# EAGLE design EMG (EAGLE 9.6.2)
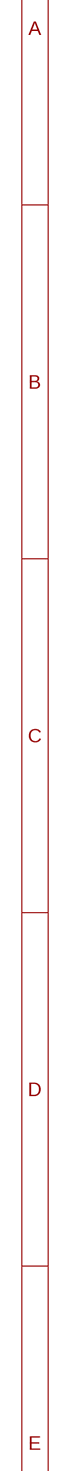
[diagram p0: schematic, sheet 1, part 1 of 2]
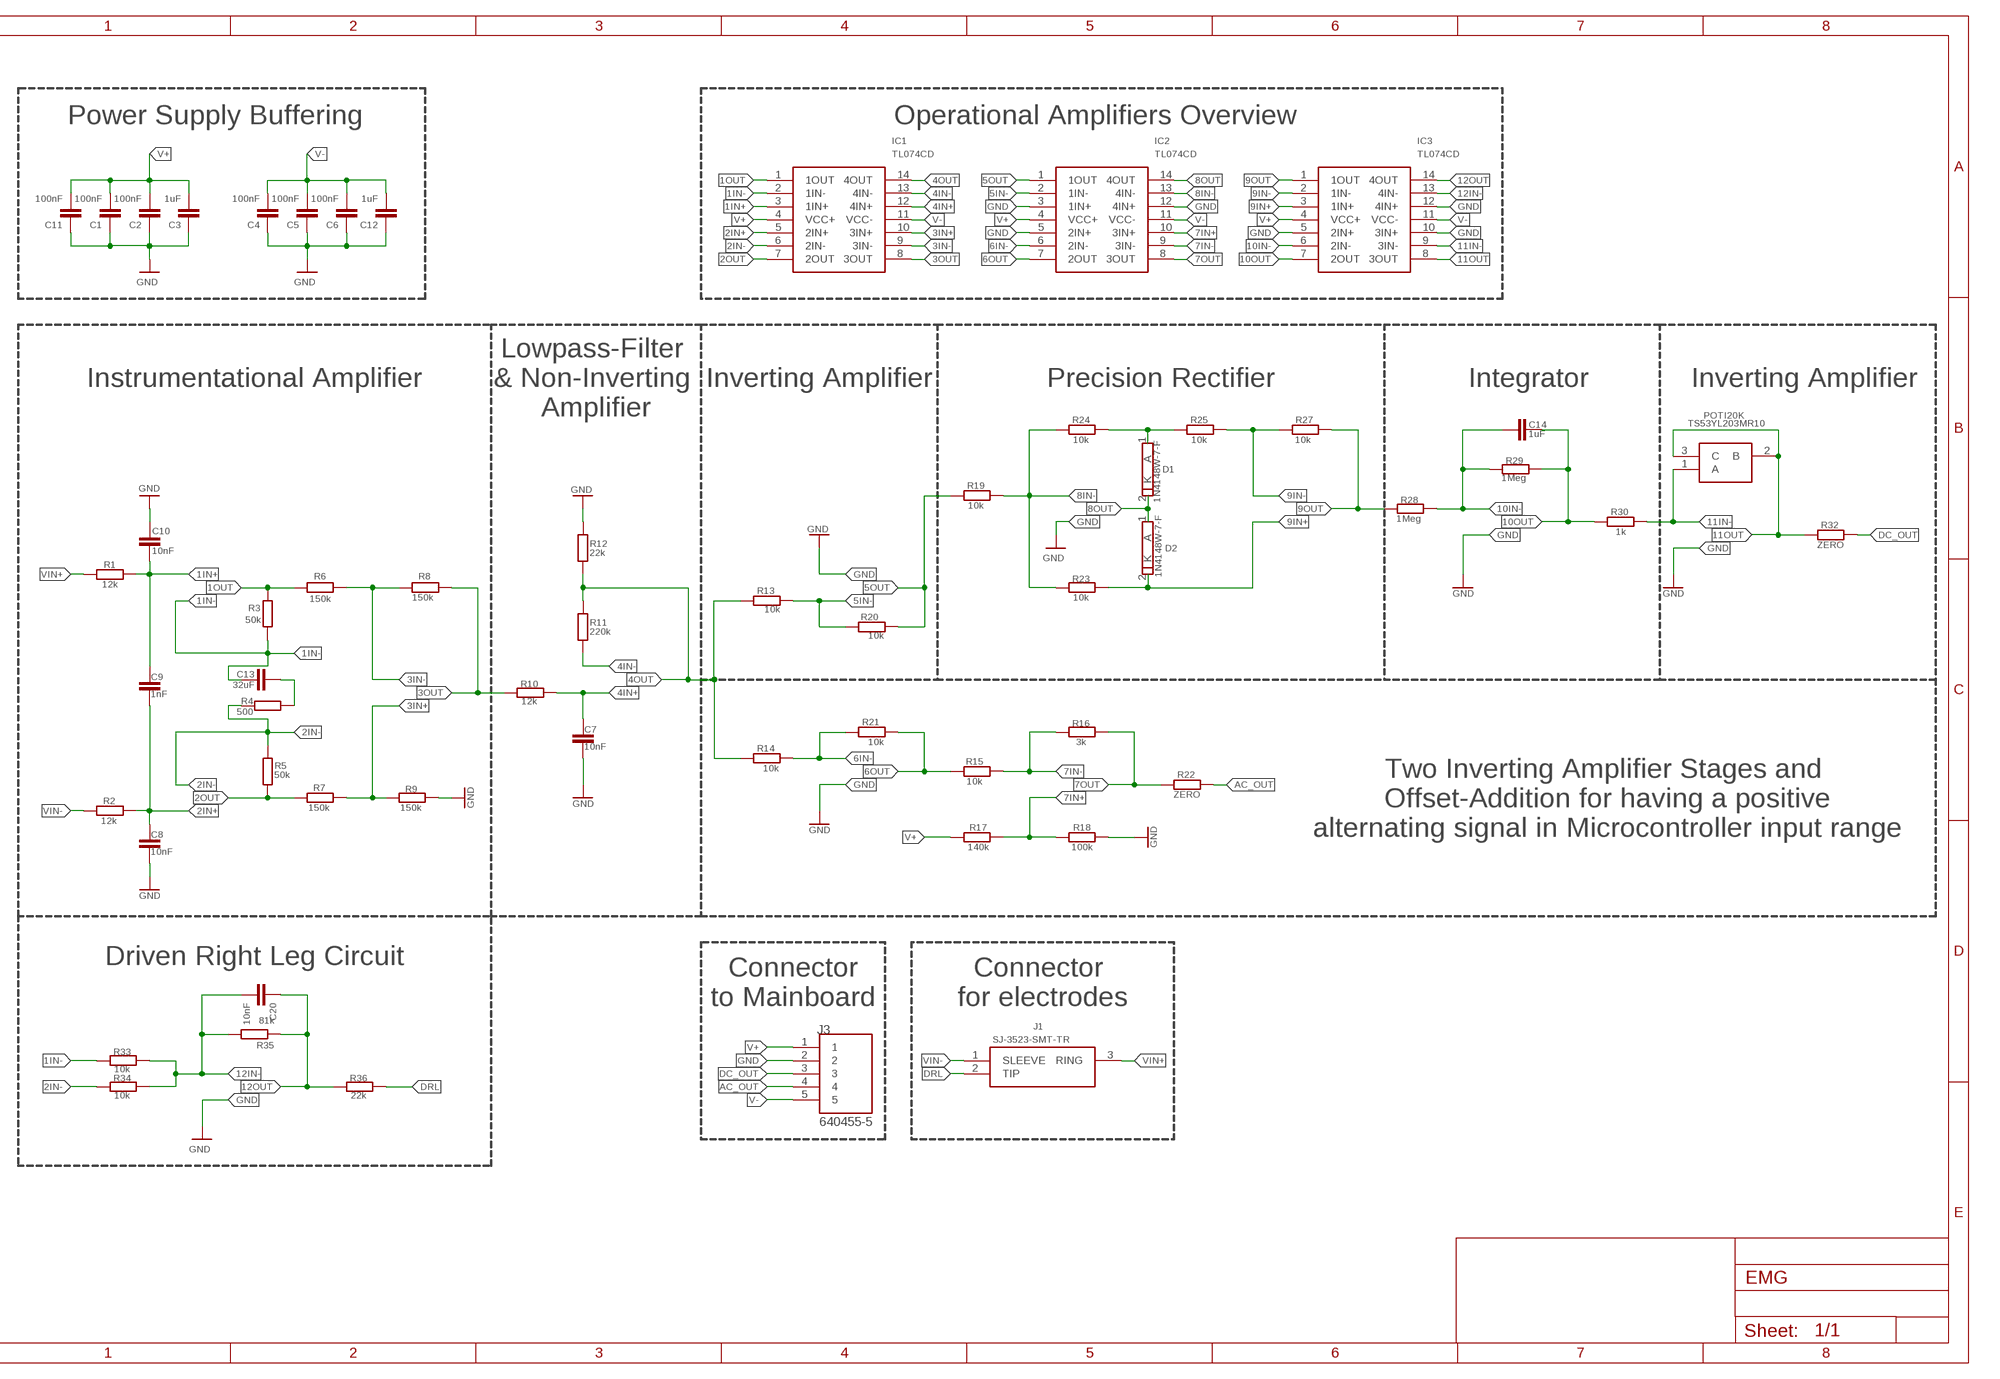
[diagram p1: schematic, sheet 1, part 2 of 2]

## Parts
C1  100nF  C-EUC0603  [C0603]
C2  100nF  C-EUC0603  [C0603]
C3  1uF  C-EUC0603  [C0603]
C4  100nF  C-EUC0603  [C0603]
C5  100nF  C-EUC0603  [C0603]
C6  100nF  C-EUC0603  [C0603]
C7  10nF  C-EUC0603  [C0603]
C8  10nF  C-EUC0603  [C0603]
C9  1nF  C-EUC0603  [C0603]
C10  10nF  C-EUC0603  [C0603]
C11  100nF  C-EUC0603  [C0603]
C12  1uF  C-EUC0603  [C0603]
C13  32uF  C-EUC0603  [C0603]
C14  1uF  C-EUC0603  [C0603]
C20  10nF  C-EUC0603  [C0603]
D1  1N4148W-7-F  [SOD3716X115N]
D2  1N4148W-7-F  [SOD3716X115N]
IC1  TL074CD  [SOIC127P600X175-14N]
IC2  TL074CD  [SOIC127P600X175-14N]
IC3  TL074CD  [SOIC127P600X175-14N]
J1  SJ-3523-SMT-TR  [SJ3523SMTTR]
J3  640455-5  [TE_640455-5]
POTI20K  TS53YL203MR10  [TS53YL203MR10]
R1  12k  R-EU_R0603  [R0603]
R2  12k  R-EU_R0603  [R0603]
R3  50k  R-EU_R0603  [R0603]
R4  500  R-EU_R0603  [R0603]
R5  50k  R-EU_R0603  [R0603]
R6  150k  R-EU_R0603  [R0603]
R7  150k  R-EU_R0603  [R0603]
R8  150k  R-EU_R0603  [R0603]
R9  150k  R-EU_R0603  [R0603]
R10  12k  R-EU_R0603  [R0603]
R11  220k  R-EU_R0603  [R0603]
R12  22k  R-EU_R0603  [R0603]
R13  10k  R-EU_R0603  [R0603]
R14  10k  R-EU_R0603  [R0603]
R15  10k  R-EU_R0603  [R0603]
R16  3k  R-EU_R0603  [R0603]
R17  140k  R-EU_R0603  [R0603]
R18  100k  R-EU_R0603  [R0603]
R19  10k  R-EU_R0603  [R0603]
R20  10k  R-EU_R0603  [R0603]
R21  10k  R-EU_R0603  [R0603]
R22  ZERO  R-EU_R0603  [R0603]
R23  10k  R-EU_R0603  [R0603]
R24  10k  R-EU_R0603  [R0603]
R25  10k  R-EU_R0603  [R0603]
R27  10k  R-EU_R0603  [R0603]
R28  1Meg  R-EU_R0603  [R0603]
R29  1Meg  R-EU_R0603  [R0603]
R30  1k  R-EU_R0603  [R0603]
R32  ZERO  R-EU_R0603  [R0603]
R33  10k  R-EU_R0603  [R0603]
R34  10k  R-EU_R0603  [R0603]
R35  81k  R-EU_R0603  [R0603]
R36  22k  R-EU_R0603  [R0603]

## Nets
1IN+: C9.1 C10.1 IC1.3(1IN+) R1.2
1IN-: C13.1 IC1.2(1IN-) R3.2 R33.2
1OUT: IC1.1(1OUT) R3.1 R6.1
2IN+: C8.2 C9.2 IC1.5(2IN+) R2.1
2IN-: IC1.6(2IN-) R4.2 R5.1 R34.2
2OUT: IC1.7(2OUT) R5.2 R7.2
3IN+: IC1.10(3IN+) R7.1 R9.2
3IN-: IC1.9(3IN-) R6.2 R8.2
3OUT: IC1.8(3OUT) R8.1 R10.2
4IN+: C7.2 IC1.12(4IN+) R10.1
4IN-: IC1.13(4IN-) R11.2
4OUT: IC1.14(4OUT) R11.1 R12.2 R13.2 R14.2
5IN-: IC2.2(1IN-) R13.1 R20.2
5OUT: IC2.1(1OUT) R19.2 R20.1
6IN-: IC2.6(2IN-) R14.1 R21.2
6OUT: IC2.7(2OUT) R15.2 R21.1
7IN+: IC2.10(3IN+) R17.2 R18.1
7IN-: IC2.9(3IN-) R15.1 R16.2
7OUT: IC2.8(3OUT) R16.1 R22.2
8IN-: IC2.13(4IN-) R19.1 R23.2 R24.2
8OUT: D1.2(K) D2.1(A) IC2.14(4OUT)
9IN+: D2.2(K) IC3.3(1IN+) R23.1
9IN-: IC3.2(1IN-) R25.1 R27.2
9OUT: IC3.1(1OUT) R27.1 R28.2
10IN-: C14.1 IC3.6(2IN-) R28.1 R29.2
10OUT: C14.2 IC3.7(2OUT) R29.1 R30.2
11IN-: IC3.9(3IN-) POTI20K.1(A) R30.1
11OUT: IC3.8(3OUT) POTI20K.2(B) POTI20K.3(C) R32.2
12IN-: C20.2 IC3.13(4IN-) R33.1 R34.1 R35.2
12OUT: C20.1 IC3.14(4OUT) R35.1 R36.2
AC_OUT: J3.4 R22.1
DC_OUT: J3.3 R32.1
DRL: J1.2(TIP) R36.1
GND: C1.1 C2.1 C3.1 C4.1 C5.1 C6.1 C7.1 C8.1 C10.2 C11.1 C12.1 IC2.3(1IN+) IC2.5(2IN+) IC2.12(4IN+) IC3.5(2IN+) IC3.10(3IN+) IC3.12(4IN+) J3.2 R9.1 R12.1 R18.2
N$1: D1.1(A) R24.1 R25.2
N$2: C13.2 R4.1
V+: C1.2 C2.2 C3.2 C11.2 IC1.4(VCC+) IC2.4(VCC+) IC3.4(VCC+) J3.1 R17.1
V-: C4.2 C5.2 C6.2 C12.2 IC1.11(VCC-) IC2.11(VCC-) IC3.11(VCC-) J3.5
VIN+: J1.3(RING) R1.1
VIN-: J1.1(SLEEVE) R2.2

## Notes on the sheet
- Power Supply Buffering | Operational Amplifiers Overview
- Instrumentational Amplifier
- Lowpass-Filter 
  & Non-Inverting 
  Amplifier
- Inverting Amplifier | Precision Rectifier | Integrator | Inverting Amplifier
- Two Inverting Amplifier Stages and 
  Offset-Addition for having a positive
  alternating signal in Microcontroller input range
- Driven Right Leg Circuit
- Connector
  to Mainboard
- Connector 
  for electrodes

## Library data of the parts
C1-C14 C20 = rcl:C-EU: CAPACITOR, European symbol; SPICEPREFIX: C
D1 D2 = SamacSys_Parts:1N4148W-7-F: Diode Switching 150mA 100V 400mW SOD123 Diodes Inc 1N4148W-7-F Switching Diode 100V, 2-Pin SOD-123 Source: Datasheet <https://componentsearchengine.com/Datasheets/1/1N4148W-7-F.pdf>; DESCRIPTION: Diode Switching 150mA 100V 400mW SOD123 Diodes Inc 1N4148W-7-F Switching Diode 100V, 2-Pin SOD-123; HEIGHT: 1.15mm; MANUFACTURER_NAME: Diodes Inc.; MANUFACTURER_PART_NUMBER: 1N4148W-7-F; MOUSER_PART_NUMBER: 621-1N4148W-F; MOUSER_PRICE-STOCK: https://www.mouser.com/Search/Refine.aspx?Keyword=621-1N4148W-F
IC1-IC3 = SamacSys_Parts:TL074CD: Quad Low-Noise JFET-Input General-Purpose Operational Amplifier Source: Datasheet <http://www.ti.com/lit/ds/symlink/tl074.pdf>; DESCRIPTION: Quad Low-Noise JFET-Input General-Purpose Operational Amplifier; HEIGHT: 1.75mm; MANUFACTURER_NAME: Texas Instruments; MANUFACTURER_PART_NUMBER: TL074CD; MOUSER_PART_NUMBER: 595-TL074CD; MOUSER_PRICE-STOCK: https://www.mouser.com/Search/Refine.aspx?Keyword=595-TL074CD
J1 = SamacSys_Parts:SJ-3523-SMT-TR: Phone Connectors Audio Jacks Source: Datasheet <https://componentsearchengine.com/Datasheets/1/SJ-3523-SMT-TR.pdf>; DESCRIPTION: Phone Connectors Audio Jacks; HEIGHT: mm; MANUFACTURER_NAME: CUI; MANUFACTURER_PART_NUMBER: SJ-3523-SMT-TR; MOUSER_PART_NUMBER: 490-SJ-3523-SMT-TR; MOUSER_PRICE-STOCK: https://www.mouser.com/Search/Refine.aspx?Keyword=490-SJ-3523-SMT-TR
J3 = 640455-5:640455-5; COMMENT: 640455-5; DESCRIPTION: MTA-100 5 Position Through Hole Single Row Right Angle Wire to Board Header; DIGI-KEY_PART_NUMBER: A19453-ND; DIGI-KEY_PURCHASE_URL: https://www.digikey.de/product-detail/en/te-connectivity-amp-connectors/640455-5/A19453-ND/259000?utm_source=snapeda&utm_medium=aggregator&utm_campaign=symbol; MF: TE Connectivity; MP: 640455-5; PACKAGE: None; TE_PURCHASE_URL: https://www.te.com/usa-en/product-640455-5.html?te_bu=Cor&te_type=disp&te_campaign=seda_glo_cor-seda-global-disp-prtnr-fy19-seda-model-bom-cta_sma-317_1&elqCampaignId=32493
POTI20K = SamacSys_Parts:TS53YL203MR10: Vishay TS53YL Series SMD Trimmer Resistor with Gull Wing Terminations, 20k +/-20% 1/4W +/-100ppm/C Top Adjust Source: Datasheet <https://componentsearchengine.com/Datasheets/1/TS53YL203MR10.pdf>; DESCRIPTION: Vishay TS53YL Series SMD Trimmer Resistor with Gull Wing Terminations, 20k +/-20% 1/4W +/-100ppm/C Top Adjust; HEIGHT: 2.7mm; MANUFACTURER_NAME: Vishay; MANUFACTURER_PART_NUMBER: TS53YL203MR10; MOUSER_PART_NUMBER: 72-TS53YL-20K; MOUSER_PRICE-STOCK: https://www.mouser.com/Search/Refine.aspx?Keyword=72-TS53YL-20K
R1-R25 R27-R30 R32-R36 = rcl:R-EU_: RESISTOR, European symbol; SPICEPREFIX: R

## Board
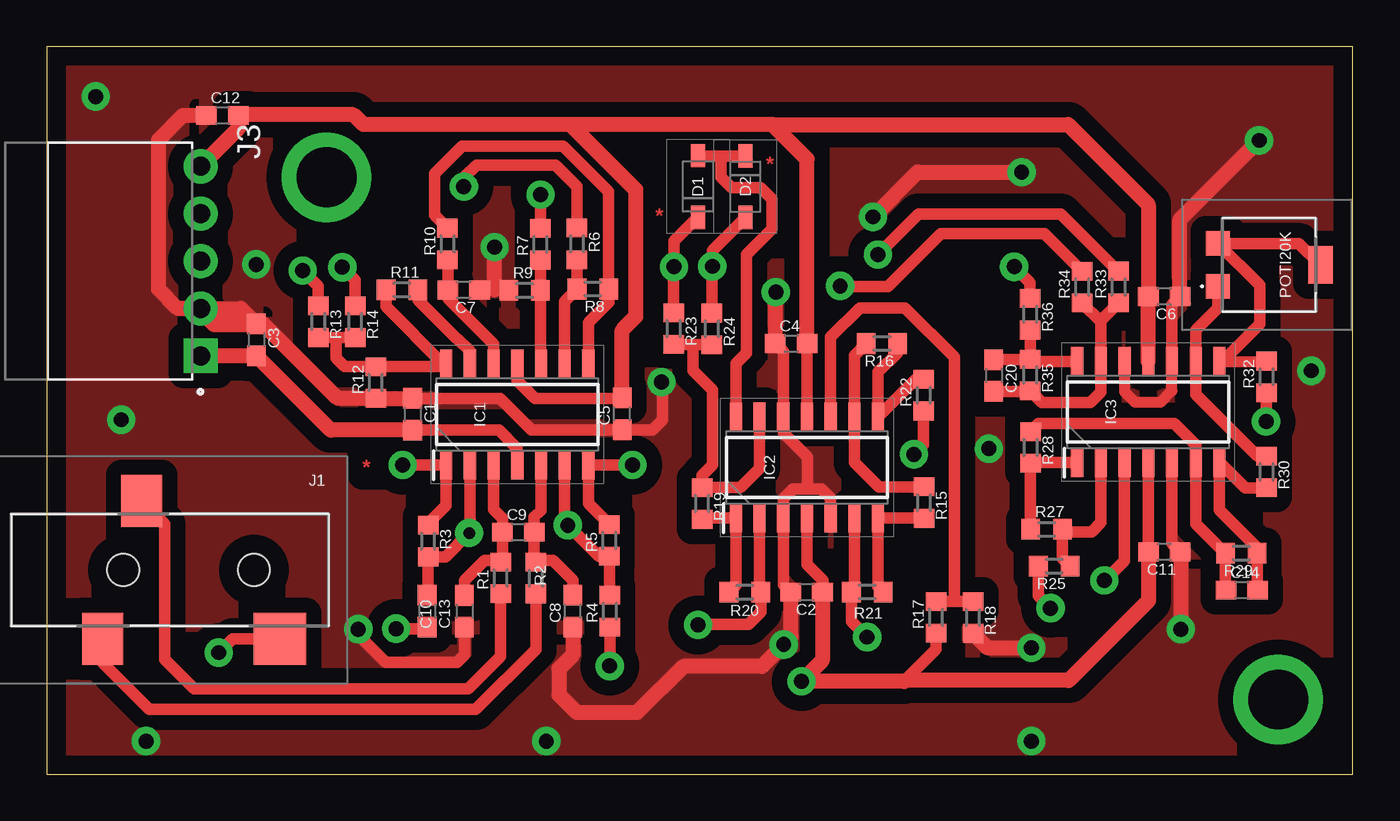
[diagram p2: board, top side]
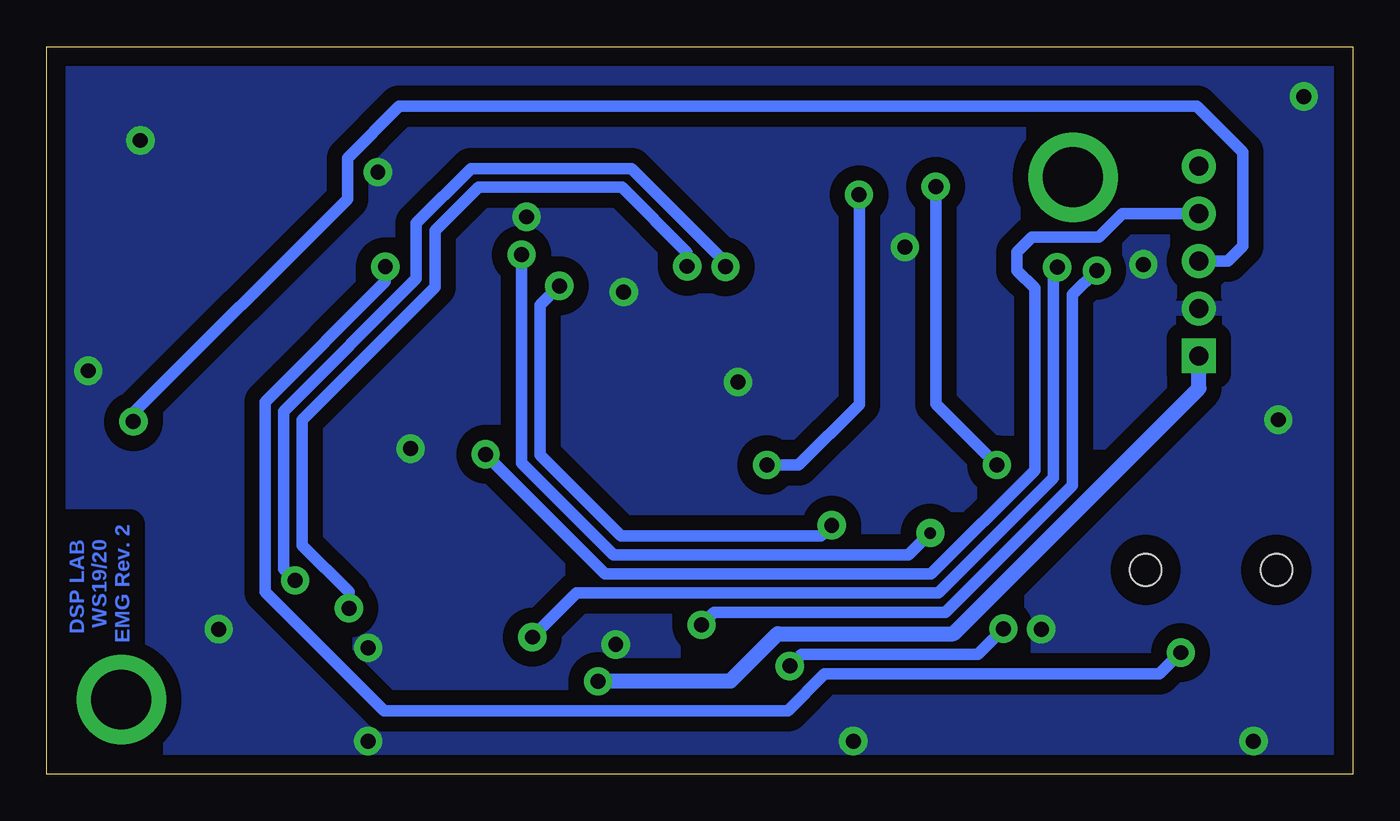
[diagram p3: board, bottom side, seen from below]

Size 70 x 39 mm. Coordinates in mm from the lower left corner, seen from the top.
Outline: 0,0 70,0 70,39 0,39 0,0
Copper layers (1*16): Top 0.035mm / dielectric 1.5mm / Bottom 0.035mm
Design rules "Projektlabor_THT_DRC_2019 *": minimum track width 0.6mm, minimum drill 0.6mm, track to track 15mil, track to pad 12mil, pad to pad 16mil, via to via 20mil, smd to smd 8mil, copper to edge 40mil, drill to drill 16mil, minimum pad ring 16mil, minimum via ring 14mil, stop-mask expansion 4mil, vias tented up to drill 0mil, thermal gap 15mil

### Footprints (pad centres in the part's own frame; a part is rotated, then mirrored left to right if it is on the bottom)
C0603 = smd 1.1 x 1: 1 -0.85,0; 2 0.85,0
SOD3716X115N = smd 1.25 x 0.75: 1 -1.65,0; 2 1.65,0
SOIC127P600X175-14N = smd 1.525 x 0.65: 1 -2.712,3.81; 2 -2.712,2.54; 3 -2.712,1.27; 4 -2.712,0; 5 -2.712,-1.27; 6 -2.712,-2.54; 7 -2.712,-3.81; 8 2.712,-3.81; 9 2.712,-2.54; 10 2.712,-1.27; 11 2.712,0; 12 2.712,1.27; 13 2.712,2.54; 14 2.712,3.81
SJ3523SMTTR = smd 2.2 x 2.8: 1 -1.1,-3.7; 3 1,3.7 | smd 2.8 x 2.8: 2 8.4,-3.7 | hole 1.7: 7,0; 0,0
TE_640455-5 = drill 1.02 pad 1.37 square: 1 0,0 | drill 1.02 pad 1.37: 2 -2.54,0; 3 -5.08,0; 4 -7.62,0; 5 -10.16,0
TS53YL203MR10 = smd 1.3 x 1.3: 1 1.15,-2.75; 3 -1.15,-2.75 | smd 2 x 1.3: 2 0,2.75
R0603 = smd 1 x 1.1: 1 -0.85,0; 2 0.85,0

### Placement (x,y rotation side)
C1  19.61,19.29 270 top
C2  40.73,9.76 0 top
C3  11.23,23.29 270 top
C4  39.91,23.09 0 top
C5  30.84,19.32 90 top
C6  59.89,25.61 180 top
C7  22.35,25.95 180 top
C8  28.2,8.74 90 top
C9  25.28,12.97 0 top
C10  22.39,8.73 270 top
C11  59.9,11.91 180 top
C12  9.41,35.31 0 top
C13  20.39,8.74 270 top
C14  64.06,9.87 0 top
C20  50.76,21.38 270 top
D1  37.44,31.49 90 top
D2  34.91,31.5 270 top
IC1  25.22,19.28 90 top
IC2  40.74,16.44 90 top
IC3  59.03,19.42 90 top
J1  4.1,10.95 0 top
J3  8.25,22.43 270 top
POTI20K  65.52,27.3 270 top
R1  24.33,10.52 90 top
R2  26.22,10.52 270 top
R3  20.45,12.5 270 top
R4  30.18,8.74 90 top
R5  30.16,12.53 90 top
R6  28.42,28.43 270 top
R7  26.45,28.41 90 top
R8  29.27,26 180 top
R9  25.61,25.93 0 top
R10  21.48,28.43 90 top
R11  19.05,25.96 0 top
R12  17.64,21 90 top
R13  14.56,24.26 270 top
R14  16.54,24.26 270 top
R15  47.02,14.56 270 top
R16  44.77,23.09 180 top
R17  47.66,8.41 90 top
R18  49.64,8.4 270 top
R19  35.12,14.51 270 top
R20  37.42,9.76 0 top
R21  43.98,9.77 180 top
R22  46.99,20.32 90 top
R23  33.6,23.89 270 top
R24  35.65,23.87 270 top
R25  54,11.15 180 top
R27  53.59,13.12 0 top
R28  52.73,17.52 270 top
R29  64.02,11.85 180 top
R30  65.38,16.2 270 top
R32  65.37,21.3 90 top
R33  57.44,26.11 90 top
R34  55.49,26.11 90 top
R35  52.71,21.39 270 top
R36  52.7,24.66 270 top

### Tracks (layer width: path | path; a pad name or v marks a point on that pad's centre or on a via)
1IN+
  Top 0.61: IC1.3 23.95,14.2 24.43,13.72 C9.1 24.43,11.47 | 24.43,11.47 R1.2 | C10.1 22.39,10.38 23.47,11.47 24.43,11.47
1IN-  (via drill 0.6 pad 1.5, 0.8 pad 1.5)
  Top 0.61: IC1.2 22.68,12.96 v22.65,12.93 21.38,11.65 R3.2 20.45,9.64 C13.1 | v44.55,27.85 46.73,30.02 54.35,30.02 57.41,26.96 R33.2
  Bottom 0.61: v22.65,12.93 23.82,11.75 39.62,11.75 44.55,16.68 v44.55,27.85
1OUT  (via drill 0.8 pad 1.5)
  Top 0.61: v19.07,16.57 19.08,16.57 IC1.1 21.41,14.41 20.45,13.45 R3.1 | v22.35,31.5 22.35,31.98 23.03,32.65 27.27,32.65 28.42,31.5 R6.1
  Bottom 0.61: v19.07,16.57 22.35,19.85 v22.35,31.5
2IN+
  Top 0.61: IC1.5 26.49,14.14 26.13,13.78 C9.2 26.13,11.46 | 26.13,11.46 R2.1 | C8.2 28.2,10.39 27.14,11.46 26.13,11.46
2IN-  (via drill 0.8 pad 1.5)
  Top 0.61: R34.2 53.47,28.98 47.91,28.98 45.08,26.15 42.55,26.15 v42.52,26.18 | IC1.6 27.76,13.35 v27.93,13.35 29.59,11.68 R5.1 30.16,9.62 R4.2
  Bottom 0.61: v42.52,26.18 43.55,25.15 43.55,17.1 39.22,12.77 28.51,12.77 v27.93,13.35
2OUT  (via drill 0.8 pad 1.5)
  Top 0.61: v31.4,16.57 30.4,16.57 30.39,16.57 IC1.7 29.03,14.51 R5.2 | v26.46,31.06 R7.2
  Bottom 0.61: v31.4,16.57 29.7,16.57 26.45,19.82 26.45,31.02 26.44,31.04 v26.46,31.06
3IN+
  Top 0.61: IC1.10 26.46,22.02 R9.2 R7.1
3IN-
  Top 0.61: R6.2 R8.2 27.76,25.34 IC1.9
3OUT
  Top 0.61: IC1.8 29.03,24.2 30.12,25.3 R8.1 30.12,31.23 27.67,33.67 22.27,33.67 20.79,32.19 20.79,29.98 R10.2
4IN+
  Top 0.61: IC1.12 23.95,23.05 21.5,25.5 C7.2 21.5,27.56 R10.1
4IN-
  Top 0.61: IC1.13 22.68,22.67 21.99,23.36 21.96,23.36 19.9,25.43 R11.2
4OUT
  Top 0.61: R11.1 18.2,25.05 21.26,21.99 IC1.14 21.26,21.84 R12.2 15.98,21.84 15.52,22.3 15.52,23.31 15.62,23.41 | R14.2 15.62,23.41 | 15.62,23.41 R13.2
5IN-  (via drill 0.8 pad 1.5)
  Top 0.61: IC2.2 38.2,9.82 R20.2 38.27,8.7 37.6,8.02 34.92,8.02 v34.9,8 | v13.73,27 14.56,26.16 R13.1
  Bottom 0.61: v13.73,27 15.02,25.7 15.02,15.47 21.83,8.67 34.23,8.67 v34.9,8
5OUT
  Top 0.61: R20.1 36.94,10.12 IC2.1 35.19,13.73 R19.2
6IN-  (via drill 0.8 pad 1.5)
  Top 0.61: IC2.6 43.28,9.93 R21.2 43.13,8.19 v43.97,7.35 | R14.1 16.54,26.48 v15.84,27.18
  Bottom 0.61: v15.84,27.18 16.06,26.96 16.06,15.87 22.2,9.72 41.59,9.72 v43.97,7.35
6OUT
  Top 0.61: R21.1 44.55,10.04 IC2.7 47,13.73 R15.2
7IN+
  Top 0.61: IC2.10 42.02,23.44 43.58,25 46,25 48.65,22.35 48.65,9.26 | R17.2 48.65,9.26 | 48.65,9.26 R18.1
7IN-
  Top 0.61: R15.1 44.59,15.41 43.28,16.71 IC2.9 43.28,22.45 R16.2
7OUT
  Top 0.61: R16.1 45.62,22.62 44.55,21.55 IC2.8 46.57,21.17 R22.2
8IN-
  Top 0.61: IC2.13 38.2,16.38 37.19,15.36 R19.1 35.12,16.02 35.67,16.57 35.67,20.6 34.62,21.65 34.62,23.04 | R23.2 34.62,23.04 | 34.62,23.04 35.63,23.04 R24.2
8OUT
  Top 0.61: D2.1 36,33.14 | 36,33.14 D1.2 | 36,33.14 36.15,32.99 36.15,32 36.7,31.45 38.25,31.45 38.88,30.82 38.88,29.23 37.5,27.85 37.5,22.57 36.94,22.01 IC2.14
9IN+  (via drill 0.8 pad 1.5)
  Top 0.61: IC3.3 57.77,11.44 56.72,10.39 v56.68,10.39 | R23.1 33.6,27.18 v33.62,27.2 33.62,28.57 D2.2
  Bottom 0.61: v56.68,10.39 57.31,11.02 57.31,19.44 50.19,26.56 50.19,29.54 47.27,32.46 38.67,32.46 33.62,27.42 v33.62,27.2
9IN-
  Top 0.61: IC3.2 56.5,13.49 56,13 54.56,13 R27.2 54.44,11.56 R25.1
9OUT
  Top 0.61: IC3.1 52.77,16.71 R28.2 52.73,13.14 R27.1
10IN-
  Top 0.61: R28.1 53.15,18.79 60.44,18.79 61.58,17.65 IC3.6 61.58,13.43 63.15,11.85 R29.2 63.17,9.9 C14.1
10OUT
  Top 0.61: R30.2 64.22,15.35 62.87,16.71 IC3.7 62.84,14.15 64.87,12.13 R29.1 64.87,9.9 C14.2
11IN-
  Top 0.61: POTI20K.1 62.77,26.14 62.77,25 61.58,23.8 IC3.9 61.58,20.35 64.88,17.05 R30.1
11OUT
  Top 0.6: IC3.8 65.36,22.13 R32.2
  Top 0.61: IC3.8 63,22.13 65,24.13 65,26.22 POTI20K.3 67.11,28.45 POTI20K.2
12IN-
  Top 0.61: 56.5,24.25 IC3.13 56.5,20.5 55.92,19.93 53.33,19.93 R35.2 52.69,20.52 C20.2 | 56.5,24.25 R34.1 | R33.1 56.5,24.32 56.5,24.25
12OUT
  Top 0.61: C20.1 52.69,22.23 | 52.69,22.23 R35.1 R36.2 | IC3.14 52.78,22.13 52.69,22.23
AC_OUT  (via drill 0.8 pad 1.5)
  Top 0.61: R22.1 46.98,19.45 46.98,17.65 v46.48,17.15
  Bottom 0.61: v46.48,17.15 40.07,10.74 22.6,10.74 17.05,16.29 17.05,26.05 18,27 18,28 17.21,28.79 13.61,28.79 12.36,30.05 J3.4
DC_OUT  (via drill 0.8 pad 1.5)
  Top 0.61: R32.1 65.37,18.92 v65.35,18.9
  Bottom 0.61: v65.35,18.9 65.35,19.35 53.88,30.82 53.88,33.02 51.1,35.8 8.35,35.8 5.9,33.35 5.9,28.3 6.7,27.5 J3.3
DRILL1  (via drill 3.2 pad 4.8)
  other vias: 15,32
DRILL2  (via drill 3.2 pad 4.8)
  other vias: 66,4
DRL  (via drill 0.8, 0.8 pad 1.5)
  Top 0.61: v51.85,27.2 52.7,26.34 R36.1 | v9.23,6.52 9.96,7.25 J1.2
  Bottom 0.61: v51.85,27.2 51.85,26.4 58.3,19.95 58.3,9.78 51.92,3.4 30.27,3.4 28.31,5.37 10.38,5.37 v9.23,6.52
GND  (via drill 0.8 pad 1.5)
  Top 0.6: IC3.12 57.77,20.51 58.33,19.95 59.7,19.95 60.3,20.55 IC3.10
  Top 0.61: C7.1 24,25.95 24.73,25.95 R9.1 | 19.61,20.34 C1.1 24.31,20.14 25.99,18.46 C5.1 | C5.1 | v32.95,21.02 33,20.98 33,19 32.46,18.46 C5.1 | 40.67,15.3 40,15.3 39.48,14.78 IC2.3 39.48,10.16 C2.1 39.9,9.73 | 40.67,15.3 41.52,15.3 42.02,14.81 IC2.5 | 40.67,15.3 40.77,15.4 40.77,17 39.48,18.3 IC2.12 39.48,22.66 C4.1 | 39.05,25.83 v39.08,25.85 | IC3.5 60.3,12.36 C11.1 | IC3.10 60.3,25.17 C6.1 | v16.7,7.77 16.7,7.48 18.18,6 22,6 22.39,6.39 C10.2
  Top 0.813: C12.1 7.31,35.31 6,34 6,26 7.03,24.96 J3.2 10.41,24.96 C3.1 | 11.61,24.14 15.6,20.14 R12.1 C1.1 | C4.1 39.05,25.83 | 39.9,9.73 39.9,7.38 39.91,7.36 v39.5,6.95 38.33,5.77 34.12,5.77 31.65,3.31 28.4,3.31 27.46,4.25 27.46,5.65 28.2,6.4 C8.1 | 24,25.95 v24,28.25 | C6.1 60.74,29.74 v64.97,33.98 | v44.27,29.88 46.67,32.27 v52.25,32.27 | C11.1 60.77,11.89 v60.77,7.77 | R18.2 50.41,6.77 v52.77,6.77
  Top 1.016: J3.2 9.03,24.18 11.18,24.18 C3.1
  other vias: 67.78,21.62 52.77,1.77 26.77,1.77 50.5,17.45 5.33,1.77 2.62,36.33 4,19 11.23,27.32
  pour Top (isolate 0.813): -36,68 -36,-22 123,-22 123,68
  pour Bottom (isolate 0.813): -46,60 -46,-24 118,-24 118,60
N$1  (via drill 0.8 pad 1.5)
  Top 0.61: R24.1 35.65,27.2 v35.67,27.23 35.67,28.07 D1.1 | R25.2 53.15,9.55 v53.8,8.9
  Bottom 0.61: v35.67,27.23 35.67,27.97 39.17,31.47 46.85,31.47 48.52,29.8 49.17,29.15 49.17,26.12 56.3,19 56.3,12.28 53.8,9.78 v53.8,8.9
N$2  (via drill 0.8 pad 1.5)
  Top 0.61: v30.18,5.8 R4.1 | C13.2 20.3,7.8 v18.73,7.8
  Bottom 0.61: v30.18,5.8 29.55,6.43 20.1,6.43 v18.73,7.8
V+  (via drill 0.8 pad 1.5)
  Top 0.61: IC1.4 25.22,17.45 24.23,18.44 C1.2 | IC2.4 40.74,11.26 41.6,10.4 41.6,9.79 C2.2 | IC3.4 59.03,11.93 C11.2 | R17.1 47.66,6.68 46,5.02 45.95,4.98
  Top 0.813: C2.2 41.58,6.1 v40.45,4.98 45.95,4.98 | 46,5.02 54.77,5.02 59.05,9.3 C11.2 | C1.2 15.23,18.44 C3.2 11.23,22.43 J3.1
  Bottom 0.813: v40.45,4.98 40.42,5 33.35,5 30.82,7.52 21.4,7.52 8.25,20.68 J3.1
V-
  Top 0.61: IC1.11 25.22,21.11 26.18,20.15 30.82,20.15 C5.2 | IC2.11 40.74,23.07 C4.2 | C6.2
  Top 0.8: IC3.11 C6.2
  Top 0.813: 38.9,34.83 28.07,34.83 | 28.07,34.83 16.98,34.83 16.45,35.35 10.3,35.35 | 38.9,34.83 54.75,34.83 59.03,30.54 C6.2 | C4.2 40.76,32.97 38.9,34.83 | C5.2 30.84,23.8 31.56,24.52 31.56,31.34 28.07,34.83 | 10.3,35.35 C12.2 | J3.5 10.3,34.64 10.3,35.35
VIN+
  Top 0.61: R1.1 24.33,6.33 22.57,4.57 7.9,4.57 6.32,6.15 6.32,13.43 J1.3
VIN-
  Top 0.61: R2.2 26.22,6.7 22.99,3.47 5.5,3.47 3,5.98 J1.1

### Text on the board
Top: * | * | *
Bottom: DSP LAB / WS19/20 / EMG Rev. 2
Measures: Bohrung: Durchmesser 3.2mm | Bohrung: Durchmesser 3.2mm